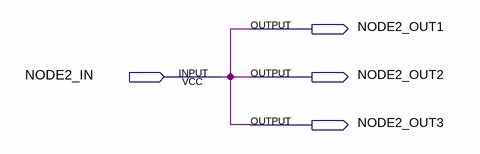
[diagram p0: schematic sheet]
// Quartus schematic NODE3.bdf as structural Verilog: 0 symbols, 4 pins
module NODE3 (
  input  NODE2_IN,
  output NODE2_OUT1,
  output NODE2_OUT2,
  output NODE2_OUT3
);


  assign NODE2_OUT1 = NODE2_IN;
  assign NODE2_OUT2 = NODE2_IN;
  assign NODE2_OUT3 = NODE2_IN;
endmodule
